# Altium schematic sheet controller.SchDoc
size A4; SheetNumber: 2; SheetTotal: 2
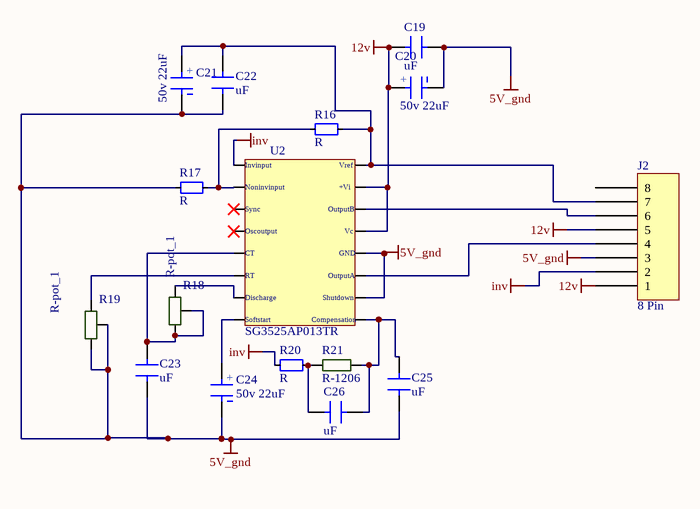
[diagram p0: controller.SchDoc]

## Parts
C19  uF  [C-1206]
C20  50v 22uF  [50v 22uf]
C21  50v 22uF  [50v 22uf]
C22  uF  [C-1206]
C23  uF  [C-1206]
C24  50v 22uF  [50v 22uf]
C25  uF  [C-1206]
C26  uF  [C-1206]
J2  8 Pin  [8 pin connector]
R16  R  [R-0805R]
R17  R  [R-0805R]
R18  R-pot_1  [pot]
R19  R-pot_1  [pot]
R20  R  [R-0805R]
R21  R-1206  [R-1206]
U2  SG3525AP013TR  [SOIC16N SG3525]

## Nets
5V_gnd: C19.1 C20.2 C21.2 C22.2 C23.1 C24.2 C25.2 J2.3 R17.1 R19.1 R19.2 U2.10 U2.12
12v: C19.2 C20.1 J2.1 J2.5 U2.13 U2.15
inv: J2.2 R20.1 U2.1
NetC21_1: C21.1 C22.1 J2.7 R16.2 U2.16
NetC23_2: C23.2 R18.1 R18.2 U2.5
NetC24_1: C24.1 U2.8
NetC25_1: C25.1 C26.2 R21.2 U2.9
NetC26_1: C26.1 R20.2 R21.1
NetJ2_4: J2.4 U2.11
NetJ2_6: J2.6 U2.14
NetR16_1: R16.1 R17.2 U2.2
NetR18_3: R18.3 U2.7
NetR19_3: R19.3 U2.6

Not connected (* = marked no-connect by the designer): J2 8; U2 3* 4*

## Notes on the sheet
- (in symbol 50v 22uF) +
- (in symbol SG3525AP013TR) Invinput; Vref; Noninvinput; +Vi; Sync; OutputB; Oscoutput; Vc; CT; GND; RT; OutputA; Discharge; Shutdown; Softstart; Compensation

## Library data of the parts
C19 C22 C23 C25 C26 = C-1206
C20 C21 C24 = 50v 22uF: Manufacturer: Nichicon; Manufacturer Part Number: LKS1J472MESZ; Capacitance: 4.7mF; Voltage Rating: 63V; Tolerance: 20%; Ripple Current: 3A; Life (Hours): 1000Hour; Supplier 1: Mouser; RoHS: Yes; Mount: Through Hole; Case/Package: Radial; Min Operating Temperature: -40°C; Max Operating Temperature: 85°C; Package Quantity: 250; Packaging: Bulk; Voltage Rating (DC): 63V; Termination: Snap in; Diameter: 22mm; Length: 45mm; Lead Pitch: 0.394inch; Height - Seated (Max): 1.772inch; Supplier Part Number 1: 647-LKS1J472MESZ; ComponentLink3Description: Link; ComponentLink3URL: https://ozdisan.com/passive-components/capacitors/aluminum-capacitors/MRW-050V220ME057-TR
R16 R17 R20 = R 0805
R18 R19 = R-pot_1: Res1206
R21 = R-1206: Res1206
U2 = SG3525AP013TR: IC REG CTRLR BCK/PSH-PULL 16SOIC; Manufacturer: STMicroelectronics; Max Supply Voltage: 35V; Output Current: 400A; Rise Time: 100ns; Number of Outputs: 2; Switching Frequency: 400kHz; Output Voltage: 5.2V; Max Frequency: 500kHz; Duty Cycle: 49%; Fall Time: 50ns; Operating Supply Current: 14mA; Max Supply Current: 20mA; Supplier 1: Digi-Key; RoHS: Yes; Stock 1: 5712; Pricing 1: 1 = 1,58000, 10 = 1,41600, 100 = 1,10400, 500 = 0,91196, 1000 = 0,71997 (USD); Mount: Surface Mount; Number of Pins: 16; Weight: 0.007079oz; Min Operating Temperature: 0°C; Max Operating Temperature: 70°C; Packaging: Tape and Reel; Package Quantity: 1; Max Duty Cycle: 49%; Radiation Hardening: No; Lead Free: Lead Free; ComponentLink1URL: http://www.st.com/content/ccc/resource/technical/document/datasheet/c0/12/98/4a/3b/1a/4b/8b/CD00000958.pdf/files/CD00000958.pdf/jcr:content/translations/en.CD00000958.pdf?src-supplier=Digi-Key; ComponentLink1Description: http://www.st.com/content/ccc/resource/technical/document/datasheet/c0/12/98/4a/3b/1a/4b/8b/CD00000958.pdf/files/CD00000958.pdf/jcr:content/translations/en.CD00000958.pdf?src-supplier=Digi-Key; ComponentLink2URL: https://www.verical.com/server-webapp/html/getDatasheet?partID=376579&src-supplier=Verical; ComponentLink2Description: https://www.verical.com/server-webapp/html/getDatasheet?partID=376579&src-supplier=Verical; ComponentLink3URL: http://www.produktinfo.conrad.com/datenblaetter/1100000-1199999/001185611-da-01-en-IC_REG_CTRLR_P_SG3525AP013TR_SOIC_16_STM.pdf?src-supplier=Conrad; ComponentLink3Description: http://www.produktinfo.conrad.com/datenblaetter/1100000-1199999/001185611-da-01-en-IC_REG_CTRLR_P_SG3525AP013TR_SOIC_16_STM.pdf?src-supplier=Conrad; Case/Package: SOIC; Supplier Part Number 1: 497-6479-1-ND; Manufacturer Part Number: SG3525AP013TR